# Altium schematic sheet 5V_Regulator.SchDoc
size A4
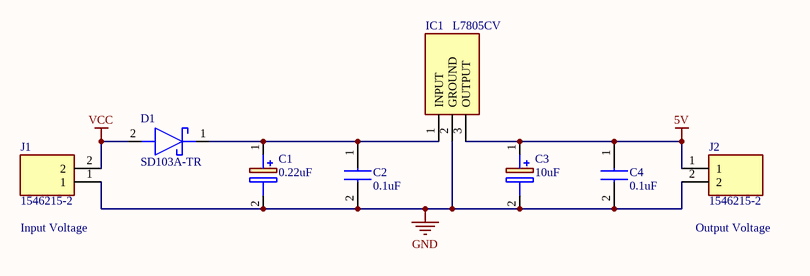
[diagram p0: 5V_Regulator.SchDoc]

## Parts
C1  0.22uF  [CAPPRD200W52D500H1250]
C2  0.1uF  [RDE5C1H100J0P1H03B]
C3  10uF  [CAPPRD200W55D500H1250]
C4  0.1uF  [RDE5C1H100J0P1H03B]
D1  SD103A-TR  [DIOAD950W60L350D150]
IC1  L7805CV  [TO255P460X1020X2008-3P]
J1  1546215-2  [15462152]
J2  1546215-2  [15462152]

## Nets
5V: C3.1(+) C4.1 IC1.3(OUTPUT) J2.1
GND: C1.2(-) C2.2 C3.2(-) C4.2 IC1.2(GROUND) J1.1 J2.2
VCC: D1.2(A) J1.2
NetC1_1: C1.1(+) C2.1 D1.1(K) IC1.1(INPUT)

## Notes on the sheet
- (near J1) Input Voltage
- (near J2) Output Voltage

## Library data of the parts
C1 = 860010772002: Capacitor Polarised; Manufacturer_Name: Wurth Elektronik; Datasheet Link: https://componentsearchengine.com/Datasheets/1/860010772002.pdf; Height: 12.5mm; Manufacturer_Part_Number: 860010772002; Mouser Part Number: 710-860010772002; Mouser Price/Stock: https://www.mouser.co.uk/ProductDetail/Wurth-Elektronik/860010772002?qs=0KOYDY2FL2%2FXueoM4QQtRg%3D%3D
C2 C4 = RDER71E104K0P1H03B: Capacitor; Manufacturer_Name: Murata Electronics; Datasheet Link: https://psearch.en.murata.com/capacitor/product/RDER71E104K0P1H03B.html; Height: 6mm; Manufacturer_Part_Number: RDER71E104K0P1H03B; Mouser Part Number: 81-RDER71E104K0P1H3B; Mouser Price/Stock: https://www.mouser.co.uk/ProductDetail/Murata-Electronics/RDER71E104K0P1H03B?qs=hNud%2FORuBR1RYUkyJwpo2Q%3D%3D; Arrow Part Number: RDER71E104K0P1H03B; Arrow Price/Stock: https://www.arrow.com/en/products/rder71e104k0p1h03b/murata-manufacturing?region=nac
C3 = EEU-FR1H100: Capacitor Polarised; Manufacturer_Name: Panasonic; Datasheet Link: http://industrial.panasonic.com/cdbs/www-data/pdf/RDF0000/ABA0000C1259.pdf; Height: 12.5mm; Manufacturer_Part_Number: EEU-FR1H100; Mouser Part Number: 667-EEU-FR1H100; Mouser Price/Stock: https://www.mouser.co.uk/ProductDetail/Panasonic/EEU-FR1H100?qs=tfZGHB2PWd1NAbdNSgjToQ%3D%3D
D1 = SD103A-TR: Schottky Diode; Manufacturer_Name: Vishay; Datasheet Link: https://componentsearchengine.com/Datasheets/5/SD103A-TR.pdf; Manufacturer_Part_Number: SD103A-TR; Mouser Part Number: 625-SD103A; Mouser Price/Stock: https://www.mouser.co.uk/ProductDetail/Vishay-Semiconductors/SD103A-TR?qs=RwahMLkpD2urFD%2FzZdGOBw%3D%3D; Arrow Part Number: SD103A-TR; Arrow Price/Stock: https://www.arrow.com/en/products/sd103a-tr/vishay?region=nac
IC1 = L7805CV: Integrated Circuit; Manufacturer_Name: STMicroelectronics; Datasheet Link: http://www.st.com/web/en/resource/technical/document/datasheet/CD00000444.pdf; Height: 4.6mm; Manufacturer_Part_Number: L7805CV; Mouser Part Number: 511-L7805CV; Mouser Price/Stock: https://www.mouser.co.uk/ProductDetail/STMicroelectronics/L7805CV?qs=9NrABl3fj%2FqplZAHiYUxWg%3D%3D; Arrow Part Number: L7805CV; Arrow Price/Stock: https://www.arrow.com/en/products/l7805cv/stmicroelectronics?region=europe
J1 J2 = 1546215-2: Connector; Manufacturer_Name: TE Connectivity; Datasheet Link: https://www.te.com/commerce/DocumentDelivery/DDEController?Action=srchrtrv&DocNm=1546215&DocType=Customer+Drawing&DocLang=English; Height: 10.3mm; Manufacturer_Part_Number: 1546215-2; Mouser Part Number: 571-1546215-2; Mouser Price/Stock: https://www.mouser.co.uk/ProductDetail/TE-Connectivity/1546215-2?qs=Lxq28tKK6BPmJFoAOY7Ljw%3D%3D; Arrow Part Number: 1546215-2; Arrow Price/Stock: https://www.arrow.com/en/products/1546215-2/te-connectivity?region=nac